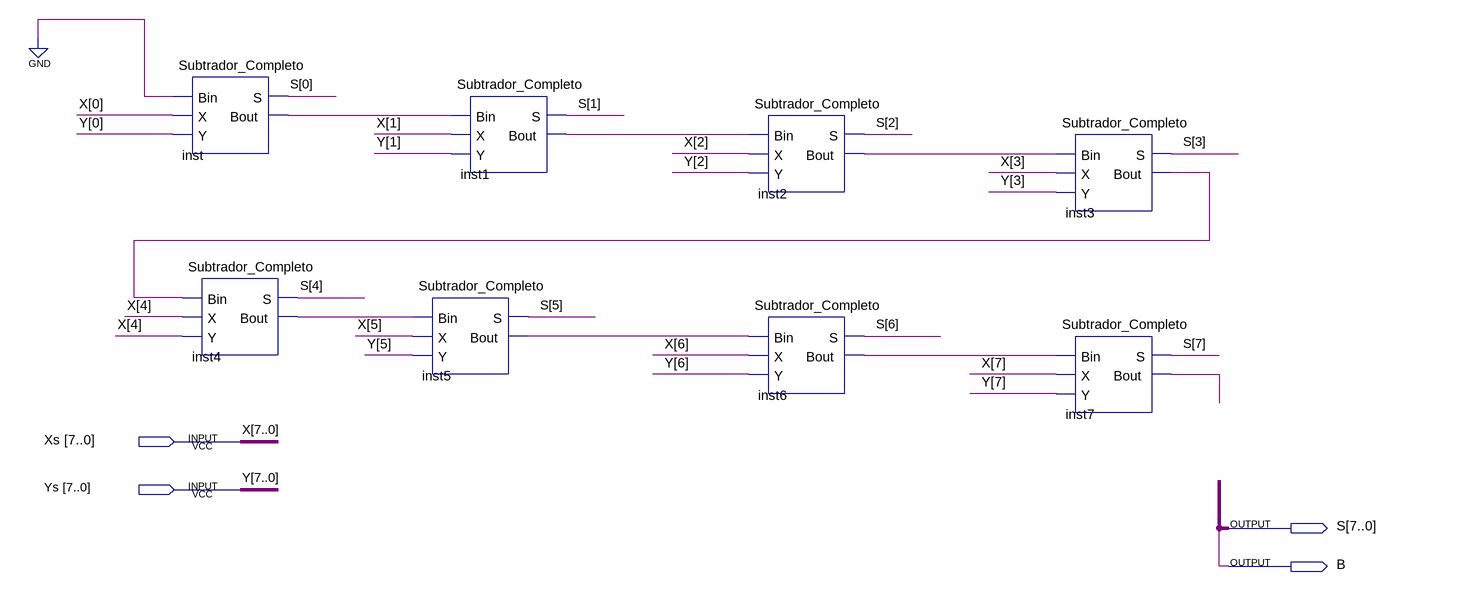
[diagram p0: schematic sheet]
// Quartus schematic Subtrador_8_Bits.bdf as structural Verilog: 8 symbols, 4 pins
module Subtrador_8_Bits (
  input  [7:0] Xs,
  input  [7:0] Ys,
  output [7:0] S,
  output B
);

  wire inst1_bout, inst2_bout, inst3_bout, inst4_bout, inst5_bout, inst6_bout, inst7_bout, inst_bout;

  Subtrador_Completo inst (.Bin(1'b0), .X(Xs[0]), .Y(Ys[0]), .S(S[0]), .Bout(inst_bout));
  Subtrador_Completo inst4 (.Bin(inst3_bout), .X(Xs[4]), .Y(Xs[4]), .S(S[4]), .Bout(inst4_bout));
  Subtrador_Completo inst5 (.Bin(inst4_bout), .X(Xs[5]), .Y(Ys[5]), .S(S[5]), .Bout(inst5_bout));
  Subtrador_Completo inst1 (.Bin(inst_bout), .X(Xs[1]), .Y(Ys[1]), .S(S[1]), .Bout(inst1_bout));
  Subtrador_Completo inst2 (.Bin(inst1_bout), .X(Xs[2]), .Y(Ys[2]), .S(S[2]), .Bout(inst2_bout));
  Subtrador_Completo inst6 (.Bin(inst5_bout), .X(Xs[6]), .Y(Ys[6]), .S(S[6]), .Bout(inst6_bout));
  Subtrador_Completo inst3 (.Bin(inst2_bout), .X(Xs[3]), .Y(Ys[3]), .S(S[3]), .Bout(inst3_bout));
  Subtrador_Completo inst7 (.Bin(inst6_bout), .X(Xs[7]), .Y(Ys[7]), .S(S[7]), .Bout(inst7_bout));

  // Other names for the same wires on the sheet: X[7:0] = Xs; Y[7:0] = Ys
endmodule
